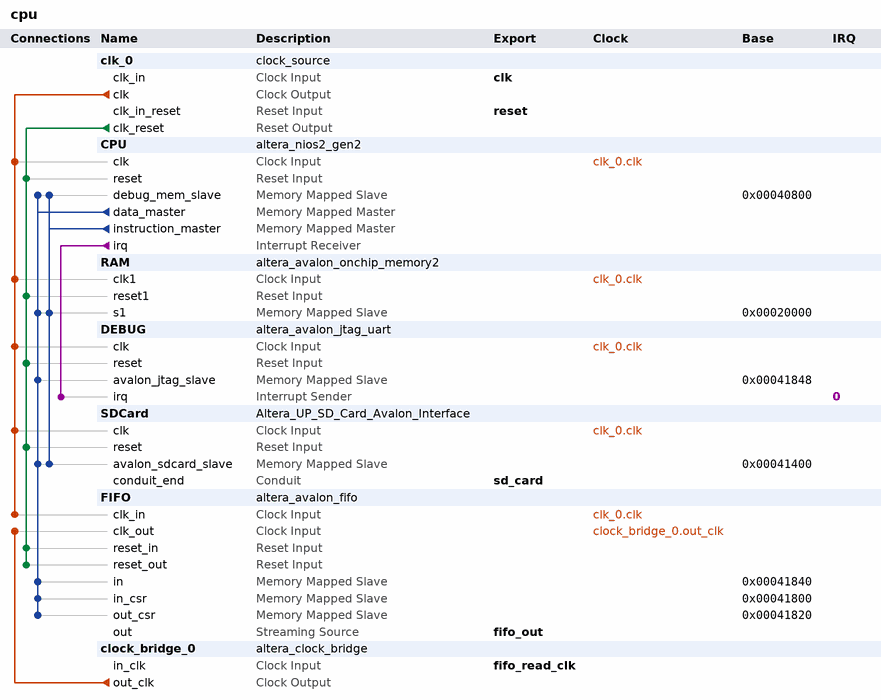
[diagram p0: system contents]
# Platform Designer (Qsys) system cpu, Cyclone IV E EP4CE115F29C7
# Parameters at their usual value, and those the tool derives, are not listed.
package require -exact qsys 17.1
create_system cpu
set_project_property DEVICE_FAMILY {Cyclone IV E}
set_project_property DEVICE EP4CE115F29C7

add_instance clk_0 clock_source 17.1
set_instance_parameter_value clk_0 clockFrequency 50000000

add_instance CPU altera_nios2_gen2 17.1
set_instance_parameter_value CPU dcache_size 2048
set_instance_parameter_value CPU exceptionSlave RAM.s1
set_instance_parameter_value CPU icache_size 4096
set_instance_parameter_value CPU impl Tiny
set_instance_parameter_value CPU resetSlave RAM.s1

add_instance RAM altera_avalon_onchip_memory2 17.1
set_instance_parameter_value RAM dataWidth 32
set_instance_parameter_value RAM dualPort false
set_instance_parameter_value RAM initMemContent true
set_instance_parameter_value RAM initializationFileName onchip_mem.hex
set_instance_parameter_value RAM memorySize 102400

add_instance DEBUG altera_avalon_jtag_uart 17.1
set_instance_parameter_value DEBUG simInteractiveOptions NO_INTERACTIVE_WINDOWS

add_instance SDCard Altera_UP_SD_Card_Avalon_Interface 17.1

add_instance FIFO altera_avalon_fifo 17.1
set_instance_parameter_value FIFO bitsPerSymbol 16
set_instance_parameter_value FIFO channelWidth 8
set_instance_parameter_value FIFO errorWidth 8
set_instance_parameter_value FIFO fifoDepth 256
set_instance_parameter_value FIFO fifoInputInterfaceOptions AVALONMM_WRITE
set_instance_parameter_value FIFO fifoOutputInterfaceOptions AVALONST_SOURCE
set_instance_parameter_value FIFO singleClockMode false
set_instance_parameter_value FIFO symbolsPerBeat 2
set_instance_parameter_value FIFO useIRQ false
set_instance_parameter_value FIFO usePacket false
set_instance_parameter_value FIFO useReadControl true

add_instance clock_bridge_0 altera_clock_bridge 17.1
set_instance_parameter_value clock_bridge_0 DERIVED_CLOCK_RATE 0
set_instance_parameter_value clock_bridge_0 EXPLICIT_CLOCK_RATE 0

# connections
add_connection clk_0.clk CPU.clk clock
add_connection clk_0.clk DEBUG.clk clock
add_connection clk_0.clk FIFO.clk_in clock
add_connection clk_0.clk RAM.clk1 clock
add_connection clk_0.clk SDCard.clk clock
add_connection clock_bridge_0.out_clk FIFO.clk_out clock
add_connection clk_0.clk_reset CPU.reset reset
add_connection clk_0.clk_reset DEBUG.reset reset
add_connection clk_0.clk_reset FIFO.reset_in reset
add_connection clk_0.clk_reset FIFO.reset_out reset
add_connection clk_0.clk_reset RAM.reset1 reset
add_connection clk_0.clk_reset SDCard.reset reset
add_connection CPU.data_master CPU.debug_mem_slave avalon
set_connection_parameter_value CPU.data_master/CPU.debug_mem_slave baseAddress 0x00040800
add_connection CPU.data_master DEBUG.avalon_jtag_slave avalon
set_connection_parameter_value CPU.data_master/DEBUG.avalon_jtag_slave baseAddress 0x00041848
add_connection CPU.data_master FIFO.in avalon
set_connection_parameter_value CPU.data_master/FIFO.in baseAddress 0x00041840
add_connection CPU.data_master FIFO.in_csr avalon
set_connection_parameter_value CPU.data_master/FIFO.in_csr baseAddress 0x00041800
add_connection CPU.data_master FIFO.out_csr avalon
set_connection_parameter_value CPU.data_master/FIFO.out_csr baseAddress 0x00041820
add_connection CPU.data_master RAM.s1 avalon
set_connection_parameter_value CPU.data_master/RAM.s1 baseAddress 0x00020000
add_connection CPU.data_master SDCard.avalon_sdcard_slave avalon
set_connection_parameter_value CPU.data_master/SDCard.avalon_sdcard_slave baseAddress 0x00041400
add_connection CPU.instruction_master CPU.debug_mem_slave avalon
set_connection_parameter_value CPU.instruction_master/CPU.debug_mem_slave baseAddress 0x00040800
add_connection CPU.instruction_master RAM.s1 avalon
set_connection_parameter_value CPU.instruction_master/RAM.s1 baseAddress 0x00020000
add_connection CPU.instruction_master SDCard.avalon_sdcard_slave avalon
set_connection_parameter_value CPU.instruction_master/SDCard.avalon_sdcard_slave baseAddress 0x00041400
add_connection CPU.irq DEBUG.irq interrupt
set_connection_parameter_value CPU.irq/DEBUG.irq irqNumber 0

# exported interfaces
add_interface clk clock sink
set_interface_property clk EXPORT_OF clk_0.clk_in
add_interface fifo_out avalon_streaming source
set_interface_property fifo_out EXPORT_OF FIFO.out
add_interface fifo_read_clk clock sink
set_interface_property fifo_read_clk EXPORT_OF clock_bridge_0.in_clk
add_interface reset reset sink
set_interface_property reset EXPORT_OF clk_0.clk_in_reset
add_interface sd_card conduit end
set_interface_property sd_card EXPORT_OF SDCard.conduit_end

set_interconnect_requirement {$system} qsys_mm.clockCrossingAdapter HANDSHAKE
set_interconnect_requirement {$system} qsys_mm.enableEccProtection FALSE
set_interconnect_requirement {$system} qsys_mm.insertDefaultSlave FALSE
set_interconnect_requirement {$system} qsys_mm.maxAdditionalLatency 1

save_system cpu.qsys
